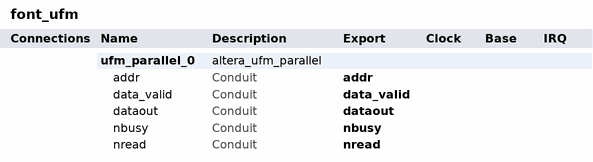
[diagram p0: system contents]
# Platform Designer (Qsys) system font_ufm, MAX II EPM1270T144C5
# Parameters at their usual value, and those the tool derives, are not listed.
package require -exact qsys 18.0
create_system font_ufm
set_project_property DEVICE_FAMILY {MAX II}
set_project_property DEVICE EPM1270T144C5

add_instance ufm_parallel_0 altera_ufm_parallel 18.0
set_instance_property ufm_parallel_0 AUTO_EXPORT true
set_instance_parameter_value ufm_parallel_0 ACCESS_MODE READ_ONLY
set_instance_parameter_value ufm_parallel_0 CBX_AUTO_BLACKBOX ALL
set_instance_parameter_value ufm_parallel_0 GUI_ERASE_TIME 500000
set_instance_parameter_value ufm_parallel_0 GUI_MEM_INIT {Initialize from hex or mif file}
set_instance_parameter_value ufm_parallel_0 GUI_OSC_FREQUENCY 5.56
set_instance_parameter_value ufm_parallel_0 GUI_PROGRAM_TIME 1600
set_instance_parameter_value ufm_parallel_0 LPM_FILE E:/intelFPGA/Projects/HydroGuard/fusion-pixel-8px-monospaced-latin.mif
set_instance_parameter_value ufm_parallel_0 OSCENA_CHECK false
set_instance_parameter_value ufm_parallel_0 OSC_CHECK false
set_instance_parameter_value ufm_parallel_0 WIDTH_ADDRESS 9
set_instance_parameter_value ufm_parallel_0 WIDTH_DATA 16
set_instance_parameter_value ufm_parallel_0 WIDTH_UFM_ADDRESS 9

# exported interfaces
add_interface addr conduit end
set_interface_property addr EXPORT_OF ufm_parallel_0.addr
add_interface data_valid conduit end
set_interface_property data_valid EXPORT_OF ufm_parallel_0.data_valid
add_interface dataout conduit end
set_interface_property dataout EXPORT_OF ufm_parallel_0.dataout
add_interface nbusy conduit end
set_interface_property nbusy EXPORT_OF ufm_parallel_0.nbusy
add_interface nread conduit end
set_interface_property nread EXPORT_OF ufm_parallel_0.nread

set_interconnect_requirement {$system} qsys_mm.clockCrossingAdapter HANDSHAKE
set_interconnect_requirement {$system} qsys_mm.enableEccProtection FALSE
set_interconnect_requirement {$system} qsys_mm.insertDefaultSlave FALSE
set_interconnect_requirement {$system} qsys_mm.maxAdditionalLatency 1

save_system font_ufm.qsys
